# EAGLE schematic mother_card_1 (EAGLE 8.3.2)

## Sheet 1 of 3
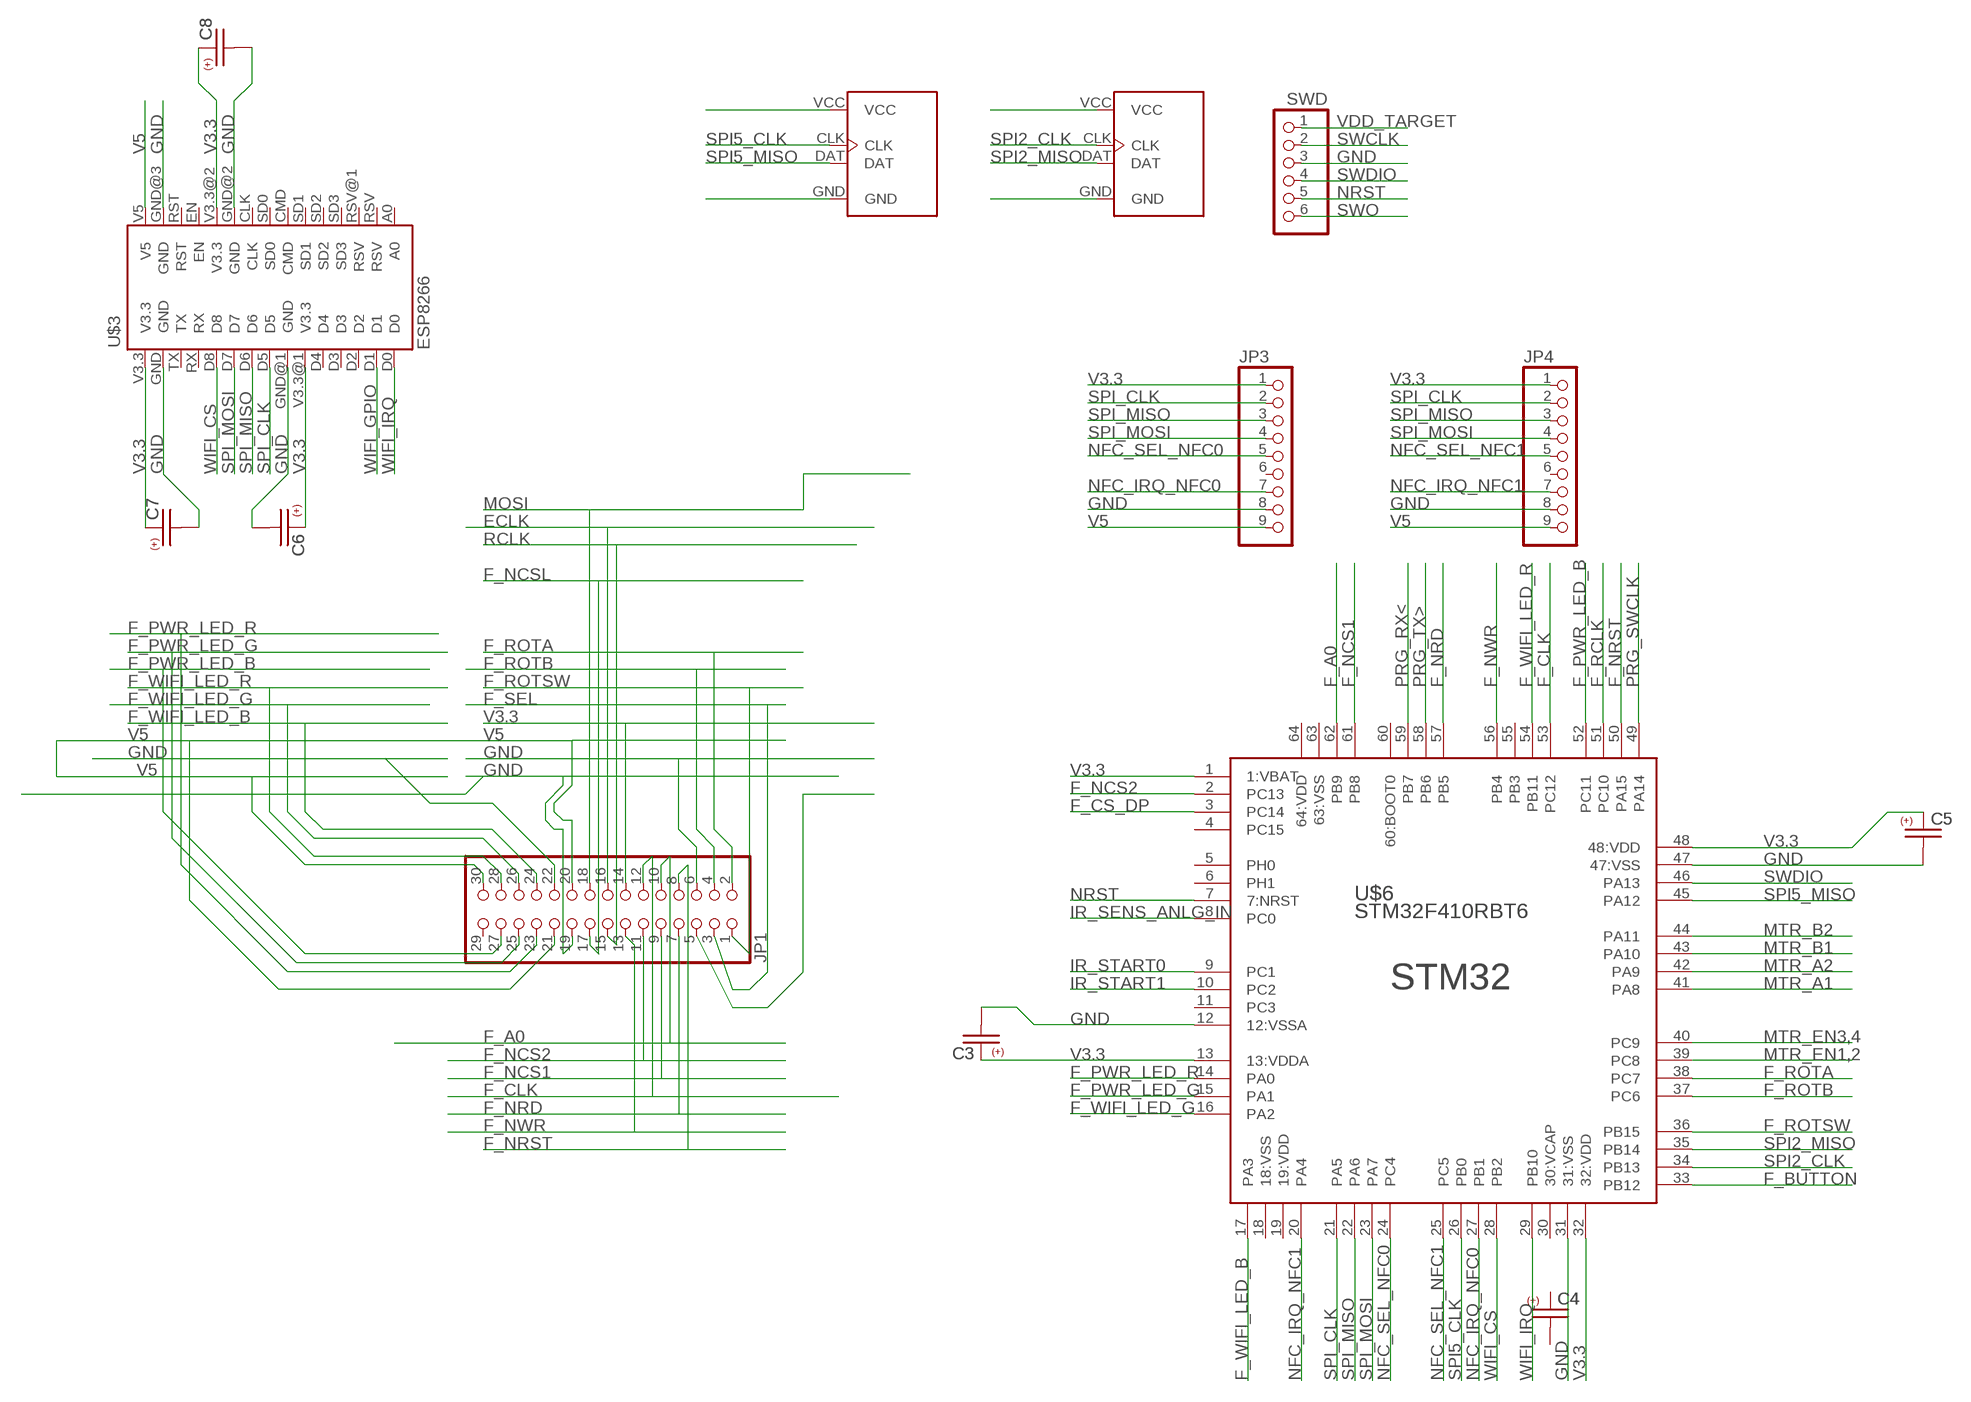
[diagram p0: schematic, sheet 1]

### Parts
C3  C-USC0805  [C0805]
C4  C-USC0805  [C0805]
C5  C-USC0805  [C0805]
C6  C-USC0805  [C0805]
C7  C-USC0805  [C0805]
C8  C-USC0805  [C0805]
JP1  PINHD-2X15/SOCK  [2X15/SOCK]
JP3  PINHD-1X9/90  [1X09/90]
JP4  PINHD-1X9/90  [1X09/90]
SWD  PINHD-1X6  [1X06]
U$1  HX711  [HX711]
U$2  HX711  [HX711]
U$3  ESP8266  [ESP8266]
U$6  STM32F410RBT6  [QFP50P1200X1200X160-64N]

### Nets
3V3B: JP1.5
ECLK: JP1.16 ; also sheet 3
F_A0: JP1.10 U$6.62(PB9) ; also sheet 3
F_BUTTON: U$6.33(PB12) ; also sheet 3
F_CLK: JP1.12 U$6.53(PC12) ; also sheet 3
F_CS_DP: U$6.3(PC14) ; also sheet 3
F_NCS1: JP1.9 U$6.61(PB8) ; also sheet 3
F_NCS2: JP1.11 U$6.2(PC13) ; also sheet 3
F_NCSL: JP1.17 ; also sheet 3
F_NRD: JP1.7 U$6.57(PB5) ; also sheet 3
F_NRST: JP1.8 U$6.50(PA15) ; also sheet 3
F_NWR: JP1.13 U$6.56(PB4) ; also sheet 3
F_PWR_LED_B: JP1.27 U$6.52(PC11) ; also sheet 3
F_PWR_LED_G: JP1.25 U$6.15(PA1) ; also sheet 3
F_PWR_LED_R: JP1.23 U$6.14(PA0) ; also sheet 3
F_RCLK: U$6.51(PC10) ; also sheet 3
F_ROTA: JP1.2 U$6.38(PC7) ; also sheet 3
F_ROTB: JP1.4 U$6.37(PC6) ; also sheet 3
F_ROTSW: JP1.1 U$6.36(PB15) ; also sheet 3
F_SEL: JP1.3 ; also sheet 3
F_WIFI_LED_B: JP1.24 U$6.17(PA3) ; also sheet 3
F_WIFI_LED_G: JP1.26 U$6.16(PA2) ; also sheet 3
F_WIFI_LED_R: JP1.28 U$6.54(PB11) ; also sheet 3
GND: C3.2 C5.2 C6.2 C7.2 C8.2 JP1.6 JP1.19 JP1.22 JP3.8 JP4.8 SWD.3 U$3.GND U$3.GND@1(GND) U$3.GND@2(GND) U$3.GND@3(GND) U$6.12(12:VSSA) U$6.31(31:VSS) U$6.47(47:VSS) ; also sheet 2,3
IR_SENS_ANLG_IN: U$6.8(PC0) ; also sheet 2,3
IR_START0: U$6.9(PC1) ; also sheet 2,3
IR_START1: U$6.10(PC2) ; also sheet 2,3
MOSI: JP1.18 ; also sheet 3
MTR_A1: U$6.41(PA8) ; also sheet 2,3
MTR_A2: U$6.42(PA9) ; also sheet 2,3
MTR_B1: U$6.43(PA10) ; also sheet 2,3
MTR_B2: U$6.44(PA11) ; also sheet 2,3
MTR_EN1,2: U$6.39(PC8) ; also sheet 2,3
MTR_EN3,4: U$6.40(PC9) ; also sheet 2,3
N$6: U$1.GND
N$7: U$2.GND
N$8: U$2.VCC
N$9: U$1.VCC
NFC_IRQ_NFC0: JP3.7 U$6.27(PB1) ; also sheet 3
NFC_IRQ_NFC1: JP4.7 U$6.20(PA4) ; also sheet 3
NFC_SEL_NFC0: JP3.5 U$6.24(PC4) ; also sheet 3
NFC_SEL_NFC1: JP4.5 U$6.25(PC5) ; also sheet 3
NRST: SWD.5 U$6.7(7:NRST) ; also sheet 3
PRG_RX<: U$6.59(PB7) ; also sheet 3
PRG_SWCLK: U$6.49(PA14) ; also sheet 3
PRG_TX>: U$6.58(PB6) ; also sheet 3
RCLK: JP1.15 ; also sheet 3
SPI2_CLK: U$2.CLK U$6.34(PB13) ; also sheet 3
SPI2_MISO: U$2.DAT U$6.35(PB14) ; also sheet 3
SPI5_CLK: U$1.CLK U$6.26(PB0) ; also sheet 3
SPI5_MISO: U$1.DAT U$6.45(PA12) ; also sheet 3
SPI_CLK: JP3.2 JP4.2 U$3.D5 U$6.21(PA5) ; also sheet 3
SPI_MISO: JP3.3 JP4.3 U$3.D6 U$6.22(PA6) ; also sheet 3
SPI_MOSI: JP3.4 JP4.4 U$3.D7 U$6.23(PA7) ; also sheet 3
SWCLK: SWD.2 ; also sheet 3
SWDIO: SWD.4 U$6.46(PA13) ; also sheet 3
SWO: SWD.6 ; also sheet 3
V3.3: C3.1 C5.1 C6.1 C7.1 C8.1 JP1.14 JP3.1 JP4.1 U$3.V3.3 U$3.V3.3@1(V3.3) U$3.V3.3@2(V3.3) U$6.1(1:VBAT) U$6.13(13:VDDA) U$6.32(32:VDD) U$6.48(48:VDD) ; also sheet 2,3
V5: JP1.20 JP1.21 JP1.30 JP3.9 JP4.9 U$3.V5 ; also sheet 2,3
VDD_TARGET: SWD.1 ; also sheet 3
WIFI_CS: U$3.D8 U$6.28(PB2) ; also sheet 3
WIFI_GPIO: U$3.D1 ; also sheet 3
WIFI_IRQ: U$3.D0 U$6.29(PB10) ; also sheet 3
Unconnected: C4.1 C4.2 JP1.29 JP3.6 JP4.6 U$3.A0 U$3.CLK U$3.CMD U$3.D2 U$3.D3 U$3.D4 U$3.EN U$3.RST U$3.RSV U$3.RSV@1(RSV) U$3.RX U$3.SD0 U$3.SD1 U$3.SD2 U$3.SD3 U$3.TX U$6.4(PC15) U$6.5(PH0) U$6.6(PH1) U$6.11(PC3) U$6.18(18:VSS) U$6.19(19:VDD) U$6.30(30:VCAP) U$6.55(PB3) U$6.60(60:BOOT0) U$6.63(63:VSS) U$6.64(64:VDD)

## Sheet 2 of 3
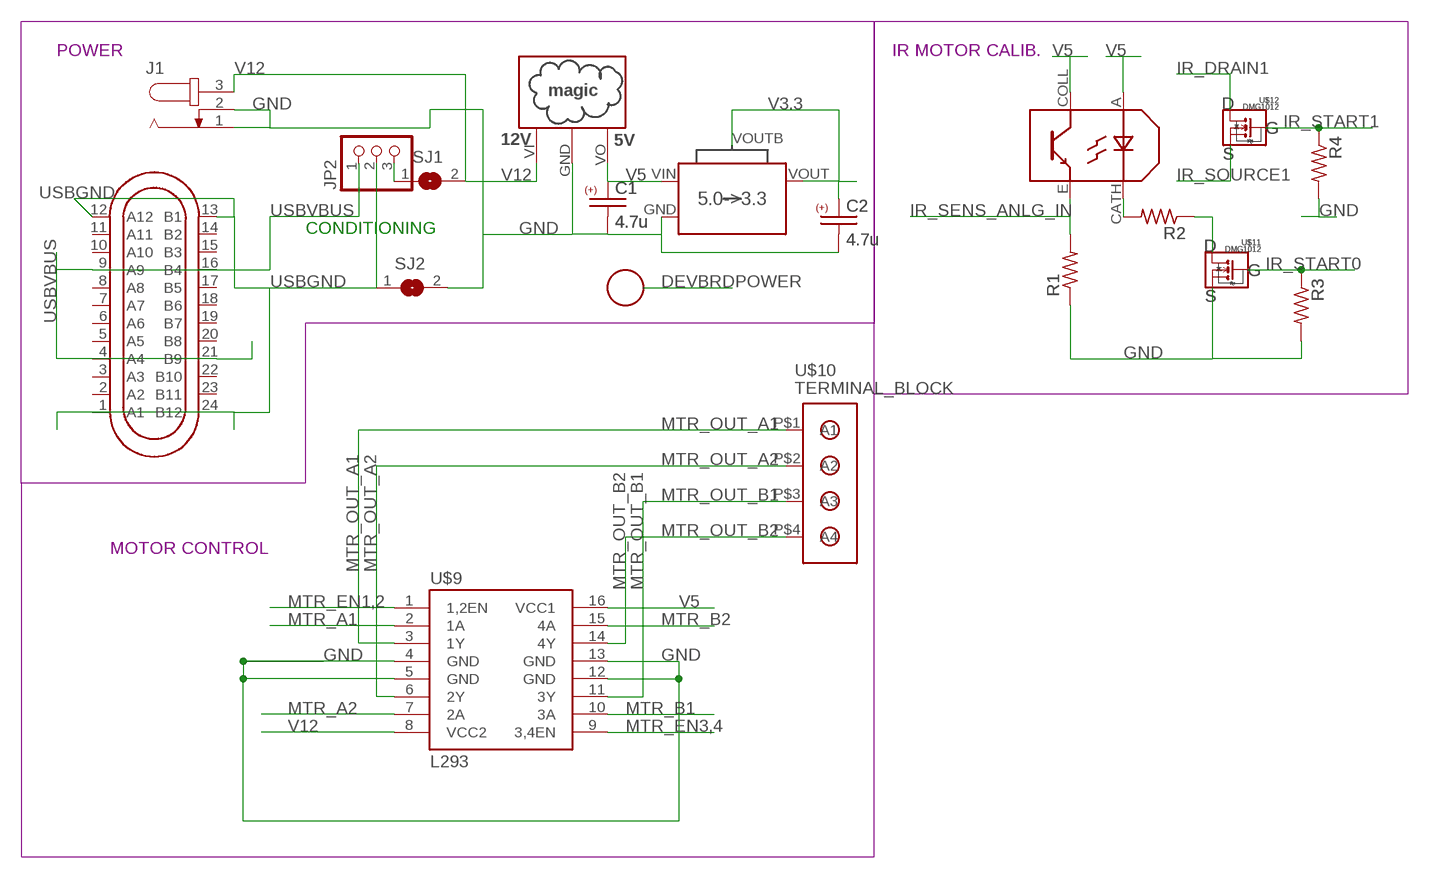
[diagram p1: schematic, sheet 2]

### Parts
C1  4.7u  C-USC0805  [C0805]
C2  4.7u  C-USC0805  [C0805]
J1  JACK-PLUG0  [SPC4077]
JP2  PINHD-1X3  [1X03]
R1  R-US_R0805  [R0805]
R2  R-US_R0805  [R0805]
R3  R-US_R0805  [R0805]
R4  R-US_R0805  [R0805]
SJ1  SJ  [SJ]
SJ2  SJ  [SJ]
U$4  OKI-78SR-W36  [SIP3]
U$5  TCRT5000  [TCRT5000]
U$7  USB-C-BRKOUT  [USB-C-BRKOUT]
U$8  AP2114H  [AP2114H]
U$9  L293  [DIL16]
U$10  TERMINAL_BLOCK  [1X4/BLOCK]
U$11  DMG1012  [SOT323]
U$12  DMG1012  [SOT323]

### Nets
GND: C1.2 C2.2 J1.1 J1.2 R1.1 R3.2 R4.2 SJ2.2 U$4.GND U$8.GND U$9.4(GND) U$9.5(GND) U$9.12(GND) U$9.13(GND) U$11.S ; also sheet 1,3
IR_DRAIN1: U$12.D ; also sheet 3
IR_SENS_ANLG_IN: R1.2 U$5.E ; also sheet 1,3
IR_SOURCE1: U$12.S ; also sheet 3
IR_START0: R3.1 U$11.G ; also sheet 1,3
IR_START1: R4.1 U$12.G ; also sheet 1,3
MTR_A1: U$9.2(1A) ; also sheet 1,3
MTR_A2: U$9.7(2A) ; also sheet 1,3
MTR_B1: U$9.10(3A) ; also sheet 1,3
MTR_B2: U$9.15(4A) ; also sheet 1,3
MTR_EN1,2: U$9.1(1,2EN) ; also sheet 1,3
MTR_EN3,4: U$9.9(3,4EN) ; also sheet 1,3
MTR_OUT_A1: U$9.3(1Y) U$10.P$1(A1) ; also sheet 3
MTR_OUT_A2: U$9.6(2Y) U$10.P$2(A2) ; also sheet 3
MTR_OUT_B1: U$9.11(3Y) U$10.P$3(A3) ; also sheet 3
MTR_OUT_B2: U$9.14(4Y) U$10.P$4(A4) ; also sheet 3
N$1: JP2.3 SJ1.1
N$2: R2.2 U$5.CATH
N$3: R2.1 U$11.D
USBGND: JP2.2 SJ2.1 U$7.1(A1) U$7.12(A12) U$7.13(B1) U$7.24(B12) ; also sheet 3
USBVBUS: JP2.1 U$7.4(A4) U$7.9(A9) U$7.16(B4) U$7.21(B9) ; also sheet 3
V3.3: C2.1 U$8.VOUT(VO) U$8.VOUTB(BODY) ; also sheet 1,3
V5: C1.1 U$4.VO U$5.A U$5.COLL U$8.VIN(VI) U$9.16(VCC1) ; also sheet 1,3
V12: J1.3 SJ1.2 U$4.VI U$9.8(VCC2) ; also sheet 3
Unconnected: U$7.2(A2) U$7.3(A3) U$7.5(A5) U$7.6(A6) U$7.7(A7) U$7.8(A8) U$7.10(A10) U$7.11(A11) U$7.14(B2) U$7.15(B3) U$7.17(B5) U$7.18(B6) U$7.19(B7) U$7.20(B8) U$7.22(B10) U$7.23(B11)

### Notes on the sheet
- POWER | IR MOTOR CALIB.
- CONDITIONING
- MOTOR CONTROL

## Sheet 3 of 3
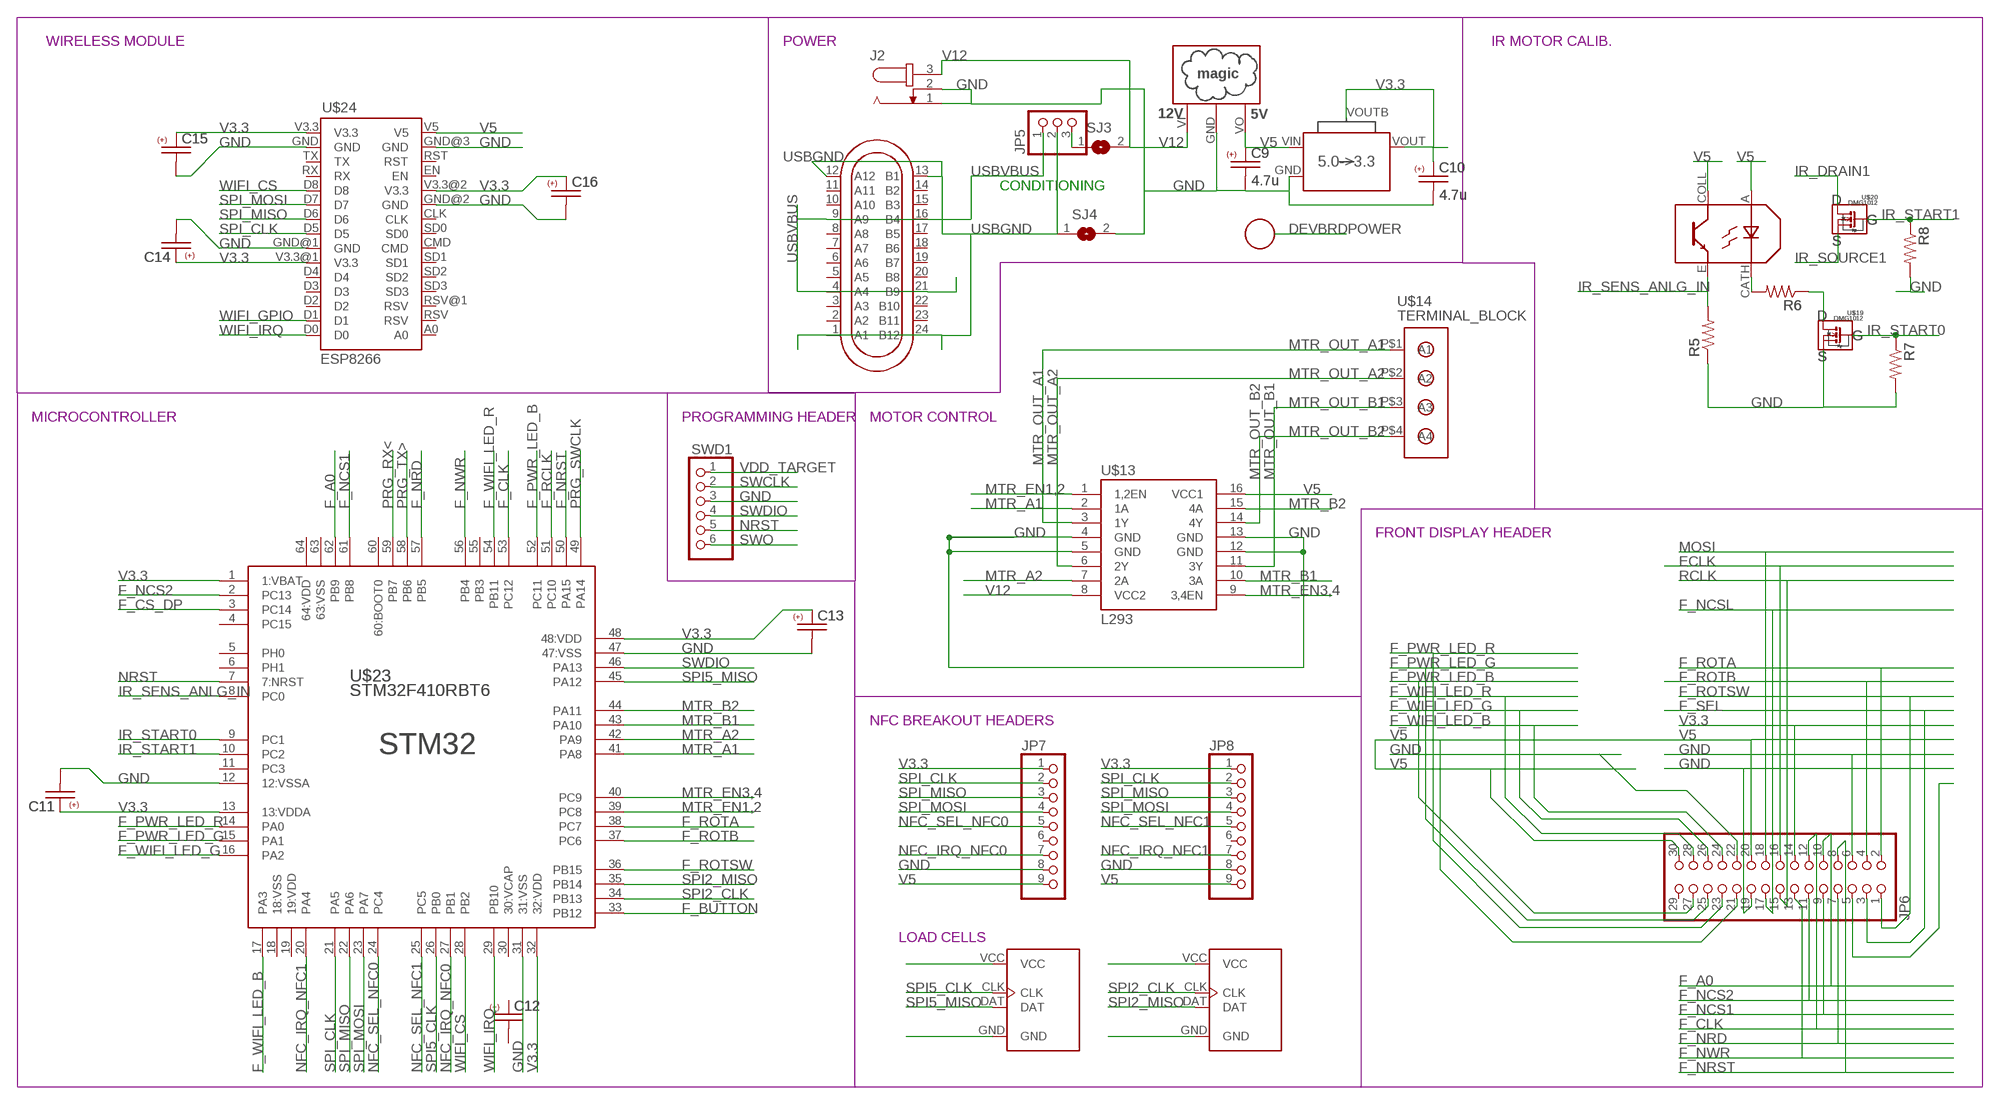
[diagram p2: schematic, sheet 3]

### Parts
C9  4.7u  C-USC0805  [C0805]
C10  4.7u  C-USC0805  [C0805]
C11  C-USC0805  [C0805]
C12  C-USC0805  [C0805]
C13  C-USC0805  [C0805]
C14  C-USC0805  [C0805]
C15  C-USC0805  [C0805]
C16  C-USC0805  [C0805]
J2  JACK-PLUG0  [SPC4077]
JP5  PINHD-1X3  [1X03]
JP6  PINHD-2X15/SOCK  [2X15/SOCK]
JP7  PINHD-1X9/90  [1X09/90]
JP8  PINHD-1X9/90  [1X09/90]
R5  R-US_R0805  [R0805]
R6  R-US_R0805  [R0805]
R7  R-US_R0805  [R0805]
R8  R-US_R0805  [R0805]
SJ3  SJ  [SJ]
SJ4  SJ  [SJ]
SWD1  PINHD-1X6  [1X06]
U$13  L293  [DIL16]
U$14  TERMINAL_BLOCK  [1X4/BLOCK]
U$15  AP2114H  [AP2114H]
U$16  OKI-78SR-W36  [SIP3]
U$17  USB-C-BRKOUT  [USB-C-BRKOUT]
U$18  TCRT5000  [TCRT5000]
U$19  DMG1012  [SOT323]
U$20  DMG1012  [SOT323]
U$21  HX711  [HX711]
U$22  HX711  [HX711]
U$23  STM32F410RBT6  [QFP50P1200X1200X160-64N]
U$24  ESP8266  [ESP8266]

### Nets
3V3B1: JP6.5
ECLK: JP6.16 ; also sheet 1
F_A0: JP6.10 U$23.62(PB9) ; also sheet 1
F_BUTTON: U$23.33(PB12) ; also sheet 1
F_CLK: JP6.12 U$23.53(PC12) ; also sheet 1
F_CS_DP: U$23.3(PC14) ; also sheet 1
F_NCS1: JP6.9 U$23.61(PB8) ; also sheet 1
F_NCS2: JP6.11 U$23.2(PC13) ; also sheet 1
F_NCSL: JP6.17 ; also sheet 1
F_NRD: JP6.7 U$23.57(PB5) ; also sheet 1
F_NRST: JP6.8 U$23.50(PA15) ; also sheet 1
F_NWR: JP6.13 U$23.56(PB4) ; also sheet 1
F_PWR_LED_B: JP6.27 U$23.52(PC11) ; also sheet 1
F_PWR_LED_G: JP6.25 U$23.15(PA1) ; also sheet 1
F_PWR_LED_R: JP6.23 U$23.14(PA0) ; also sheet 1
F_RCLK: U$23.51(PC10) ; also sheet 1
F_ROTA: JP6.2 U$23.38(PC7) ; also sheet 1
F_ROTB: JP6.4 U$23.37(PC6) ; also sheet 1
F_ROTSW: JP6.1 U$23.36(PB15) ; also sheet 1
F_SEL: JP6.3 ; also sheet 1
F_WIFI_LED_B: JP6.24 U$23.17(PA3) ; also sheet 1
F_WIFI_LED_G: JP6.26 U$23.16(PA2) ; also sheet 1
F_WIFI_LED_R: JP6.28 U$23.54(PB11) ; also sheet 1
GND: C9.2 C10.2 C11.2 C13.2 C14.2 C15.2 C16.2 J2.1 J2.2 JP6.6 JP6.22 JP7.8 JP8.8 R5.1 R7.2 R8.2 SJ4.2 SWD1.3 U$13.4(GND) U$13.5(GND) U$13.12(GND) U$13.13(GND) U$15.GND U$16.GND U$19.S U$23.12(12:VSSA) U$23.31(31:VSS) U$23.47(47:VSS) U$24.GND U$24.GND@1(GND) U$24.GND@2(GND) U$24.GND@3(GND) ; also sheet 1,2
IR_DRAIN1: U$20.D ; also sheet 2
IR_SENS_ANLG_IN: R5.2 U$18.E U$23.8(PC0) ; also sheet 1,2
IR_SOURCE1: U$20.S ; also sheet 2
IR_START0: R7.1 U$19.G U$23.9(PC1) ; also sheet 1,2
IR_START1: R8.1 U$20.G U$23.10(PC2) ; also sheet 1,2
MOSI: JP6.18 ; also sheet 1
MTR_A1: U$13.2(1A) U$23.41(PA8) ; also sheet 1,2
MTR_A2: U$13.7(2A) U$23.42(PA9) ; also sheet 1,2
MTR_B1: U$13.10(3A) U$23.43(PA10) ; also sheet 1,2
MTR_B2: U$13.15(4A) U$23.44(PA11) ; also sheet 1,2
MTR_EN1,2: U$13.1(1,2EN) U$23.39(PC8) ; also sheet 1,2
MTR_EN3,4: U$13.9(3,4EN) U$23.40(PC9) ; also sheet 1,2
MTR_OUT_A1: U$13.3(1Y) U$14.P$1(A1) ; also sheet 2
MTR_OUT_A2: U$13.6(2Y) U$14.P$2(A2) ; also sheet 2
MTR_OUT_B1: U$13.11(3Y) U$14.P$3(A3) ; also sheet 2
MTR_OUT_B2: U$13.14(4Y) U$14.P$4(A4) ; also sheet 2
N$4: JP5.3 SJ3.1
N$5: R6.2 U$18.CATH
N$10: R6.1 U$19.D
N$11: U$21.GND
N$12: U$22.GND
N$13: U$22.VCC
N$14: U$21.VCC
N$15: JP6.19
NFC_IRQ_NFC0: JP7.7 U$23.27(PB1) ; also sheet 1
NFC_IRQ_NFC1: JP8.7 U$23.20(PA4) ; also sheet 1
NFC_SEL_NFC0: JP7.5 U$23.24(PC4) ; also sheet 1
NFC_SEL_NFC1: JP8.5 U$23.25(PC5) ; also sheet 1
NRST: SWD1.5 U$23.7(7:NRST) ; also sheet 1
PRG_RX<: U$23.59(PB7) ; also sheet 1
PRG_SWCLK: U$23.49(PA14) ; also sheet 1
PRG_TX>: U$23.58(PB6) ; also sheet 1
RCLK: JP6.15 ; also sheet 1
SPI2_CLK: U$22.CLK U$23.34(PB13) ; also sheet 1
SPI2_MISO: U$22.DAT U$23.35(PB14) ; also sheet 1
SPI5_CLK: U$21.CLK U$23.26(PB0) ; also sheet 1
SPI5_MISO: U$21.DAT U$23.45(PA12) ; also sheet 1
SPI_CLK: JP7.2 JP8.2 U$23.21(PA5) U$24.D5 ; also sheet 1
SPI_MISO: JP7.3 JP8.3 U$23.22(PA6) U$24.D6 ; also sheet 1
SPI_MOSI: JP7.4 JP8.4 U$23.23(PA7) U$24.D7 ; also sheet 1
SWCLK: SWD1.2 ; also sheet 1
SWDIO: SWD1.4 U$23.46(PA13) ; also sheet 1
SWO: SWD1.6 ; also sheet 1
USBGND: JP5.2 SJ4.1 U$17.1(A1) U$17.12(A12) U$17.13(B1) U$17.24(B12) ; also sheet 2
USBVBUS: JP5.1 U$17.4(A4) U$17.9(A9) U$17.16(B4) U$17.21(B9) ; also sheet 2
V3.3: C10.1 C11.1 C13.1 C14.1 C15.1 C16.1 JP6.14 JP7.1 JP8.1 U$15.VOUT(VO) U$15.VOUTB(BODY) U$23.1(1:VBAT) U$23.13(13:VDDA) U$23.32(32:VDD) U$23.48(48:VDD) U$24.V3.3 U$24.V3.3@1(V3.3) U$24.V3.3@2(V3.3) ; also sheet 1,2
V5: C9.1 JP6.20 JP6.21 JP6.30 JP7.9 JP8.9 U$13.16(VCC1) U$15.VIN(VI) U$16.VO U$18.A U$18.COLL U$24.V5 ; also sheet 1,2
V12: J2.3 SJ3.2 U$13.8(VCC2) U$16.VI ; also sheet 2
VDD_TARGET: SWD1.1 ; also sheet 1
WIFI_CS: U$23.28(PB2) U$24.D8 ; also sheet 1
WIFI_GPIO: U$24.D1 ; also sheet 1
WIFI_IRQ: U$23.29(PB10) U$24.D0 ; also sheet 1
Unconnected: C12.1 C12.2 JP6.29 JP7.6 JP8.6 U$17.2(A2) U$17.3(A3) U$17.5(A5) U$17.6(A6) U$17.7(A7) U$17.8(A8) U$17.10(A10) U$17.11(A11) U$17.14(B2) U$17.15(B3) U$17.17(B5) U$17.18(B6) U$17.19(B7) U$17.20(B8) U$17.22(B10) U$17.23(B11) U$23.4(PC15) U$23.5(PH0) U$23.6(PH1) U$23.11(PC3) U$23.18(18:VSS) U$23.19(19:VDD) U$23.30(30:VCAP) U$23.55(PB3) U$23.60(60:BOOT0) U$23.63(63:VSS) U$23.64(64:VDD) U$24.A0 U$24.CLK U$24.CMD U$24.D2 U$24.D3 U$24.D4 U$24.EN U$24.RST U$24.RSV U$24.RSV@1(RSV) U$24.RX U$24.SD0 U$24.SD1 U$24.SD2 U$24.SD3 U$24.TX

### Notes on the sheet
- WIRELESS MODULE | POWER | IR MOTOR CALIB.
- CONDITIONING
- MICROCONTROLLER | PROGRAMMING HEADER | MOTOR CONTROL
- FRONT DISPLAY HEADER
- NFC BREAKOUT HEADERS
- LOAD CELLS

## Library data of the parts
C1-C16 = seniorDesign:C-US: CAPACITOR, American symbol
J1 J2 = con-jack:JACK-PLUG: DC POWER JACK Power Jack, DC, Right Angle, Through Hole, Rated 5A at 16VDC, PC Terminals Distributor: Farnell (www.Farnell.de) Drawing: 84N1161.pdf / 84N1162.pdf Manufacturer: SPC Technology (www.spctechnology.com) Type: SPC4077 / SPC 4078; OC_FARNELL: unknown; OC_NEWARK: unknown
JP1 JP6 = csomers:PINHD-2X15: PIN HEADER, socket for parallel cable, IDC connector, On Shore Technology Inc.
JP2 JP5 = pinhead:PINHD-1X3: PIN HEADER
JP3 JP4 JP7 JP8 = pinhead:PINHD-1X9: PIN HEADER
R1-R8 = seniorDesign:R-US_: RESISTOR, American symbol
SJ1-SJ4 = jumper:SJ: SMD solder JUMPER
SWD SWD1 = pinhead:PINHD-1X6: PIN HEADER
U$1 U$2 U$21 U$22 = seniorDesign:HX711: old green circuit board rendition of HX711 load amplifier
U$3 U$24 = seniorDesign:ESP8266: ESP8266 Wifi Module Breakout
U$4 U$16 = seniorDesign:OKI-78SR-W36
U$5 U$18 = seniorDesign:TCRT5000: Vishay Semiconductor Opto Division TCRT5000 mother board cover repositioning http://www.vishay.com/docs/83760/tcrt5000.pdf
U$6 U$23 = seniorDesign:STM32F410RBT6: STMicroelectronics STM32F410RBT6 main microcontroller, motherboard http://www.st.com/.../content/translations/en.DM00214043.pdf <http://www.st.com/content/ccc/resource/technical/document/datasheet/6e/f3/b0/1b/05/eb/49/fe/DM00214043.pdf/files/DM00214043.pdf/jcr:content/translations/en.DM00214043.pdf>
U$7 U$17 = usb:USB-C-BRKOUT
U$8 U$15 = seniorDesign:AP2114: AP2114H-3.3TRG1DICT-ND 5V LDO, main 5V line, motherboard https://www.diodes.com/assets/Datasheets/AP2114.pdf
U$9 U$13 = seniorDesign:L293: L293 Stepper Motor Driver
U$10 U$14 = seniorDesign:TERMINAL_BLOCK: Terminal Block for stepper motor connections
U$11 U$12 U$19 U$20 = seniorDesign:DMG1012: DMG1012UW-7DICT-ND https://www.diodes.com/assets/Datasheets/ds31859.pdf Vt ~= 1.25V, IDS ~= 0.900 A, [VGS = (3.3 - 0.7)V, VDS = 0V]